# Altium project MAGI'sDIPBoard.PrjPcb
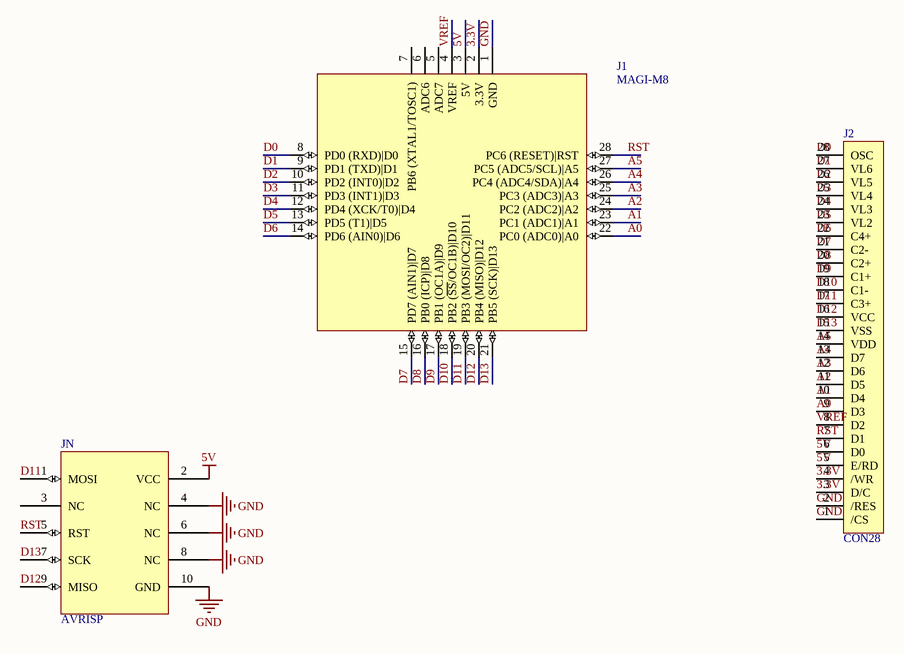
[diagram p0: MAGI'sDIPBoard.SchDoc]
1 sheet, 3 parts. Net scope: global (net labels, ports and power ports of the same name join across sheets).
Board file: MAGI'sDIPBoard.PcbDoc

## Sheet MAGI'sDIPBoard.SchDoc
size A4

### Parts
J1  MAGI-M8  [MAGI-M8]
J2  CON28  [28P3]
JN  AVRISP  [AVRISP]

### Nets
5V: J1.3(5V) J2.5(E/RD) J2.6(D0) JN.2(VCC)
GND: J1.1(GND) J2.1(/CS) J2.2(/RES) JN.4(NC) JN.6(NC) JN.8(NC) JN.10(GND)
3.3V: J1.2(3.3V) J2.3(D/C) J2.4(/WR)
A0: J1.22(PC0_(ADC0)|A0) J2.9(D3)
A1: J1.23(PC1_(ADC1)|A1) J2.10(D4)
A2: J1.24(PC2_(ADC2)|A2) J2.11(D5)
A3: J1.25(PC3_(ADC3)|A3) J2.12(D6)
A4: J1.26(PC4_(ADC4/SDA)|A4) J2.13(D7)
A5: J1.27(PC5_(ADC5/SCL)|A5) J2.14(VDD)
D0: J1.8(PD0_(RXD)|D0) J2.28(OSC)
D1: J1.9(PD1_(TXD)|D1) J2.27(VL6)
D2: J1.10(PD2_(INT0)|D2) J2.26(VL5)
D3: J1.11(PD3_(INT1)|D3) J2.25(VL4)
D4: J1.12(PD4_(XCK/T0)|D4) J2.24(VL3)
D5: J1.13(PD5_(T1)|D5) J2.23(VL2)
D6: J1.14(PD6_(AIN0)|D6) J2.22(C4+)
D7: J1.15(PD7_(AIN1)|D7) J2.21(C2-)
D8: J1.16(PB0_(ICP)|D8) J2.20(C2+)
D9: J1.17(PB1_(OC1A)|D9) J2.19(C1+)
D10: J1.18(PB2_(~{SS}/OC1B)|D10) J2.18(C1-)
D11: J1.19(PB3_(MOSI/OC2)|D11) J2.17(C3+) JN.1(MOSI)
D12: J1.20(PB4_(MISO)|D12) J2.16(VCC) JN.9(MISO)
D13: J1.21(PB5_(SCK)|D13) J2.15(VSS) JN.7(SCK)
RST: J1.28(PC6_(RESET)|RST) J2.7(D1) JN.5(RST)
VREF: J1.4(VREF) J2.8(D2)

Not connected (* = marked no-connect by the designer): J1 5(ADC7) 6(ADC6) 7(PB6_(XTAL1/TOSC1)); JN 3(NC)

### Library data of the parts
J2 = CON28: Connector